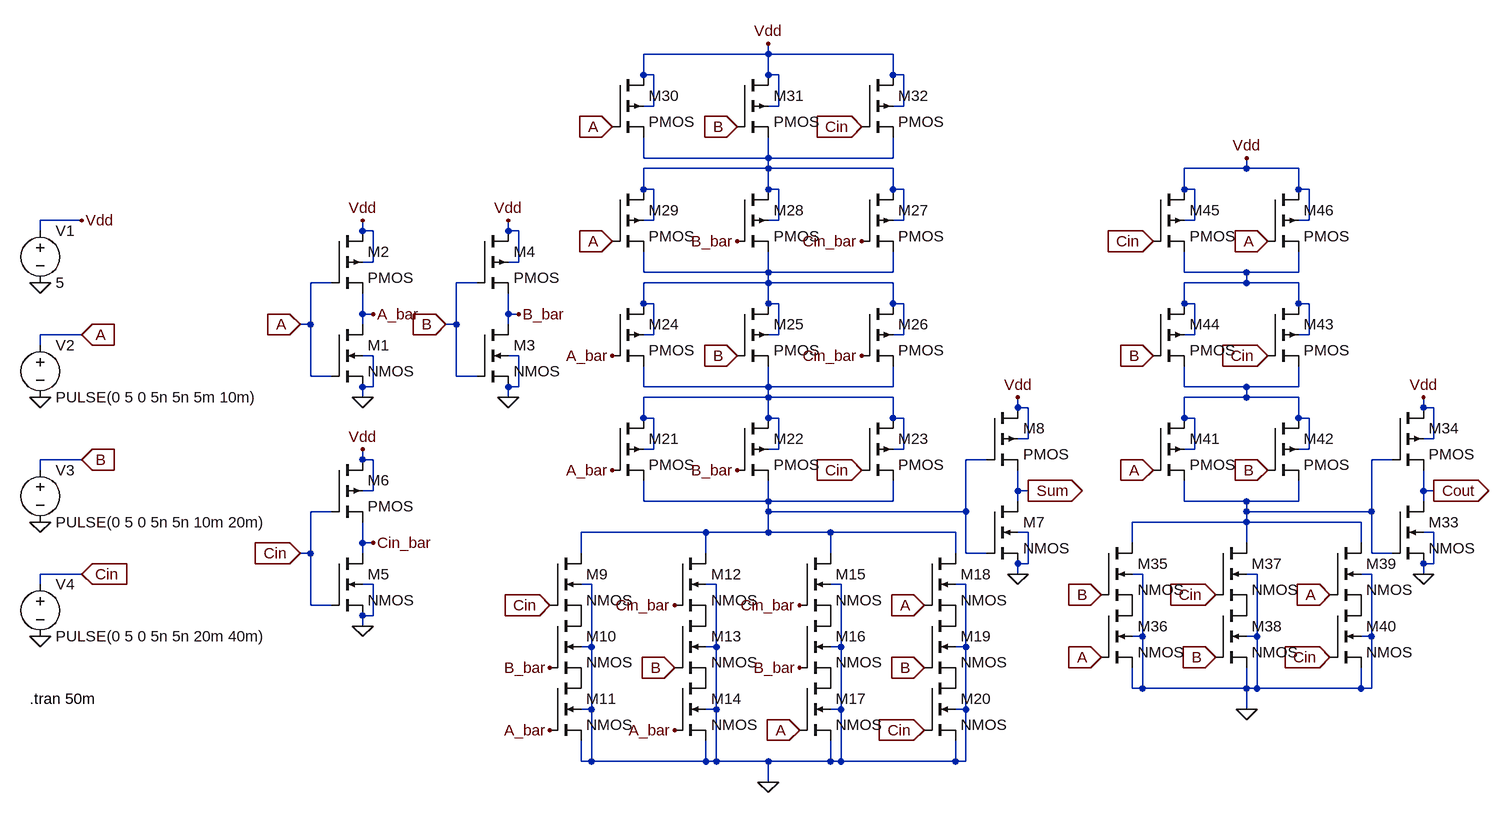
[diagram p0: schematic Full_Adder.asc]
Full_Adder.asc, the LTspice schematic file:
Version 4.1
SHEET 1 2416 1124
WIRE 1056 -224 1056 -240
WIRE 1056 -224 864 -224
WIRE 1248 -224 1056 -224
WIRE 864 -192 864 -224
WIRE 880 -192 864 -192
WIRE 1056 -192 1056 -224
WIRE 1072 -192 1056 -192
WIRE 1248 -192 1248 -224
WIRE 1264 -192 1248 -192
WIRE 880 -144 880 -192
WIRE 880 -144 864 -144
WIRE 1072 -144 1072 -192
WIRE 1072 -144 1056 -144
WIRE 1264 -144 1264 -192
WIRE 1264 -144 1248 -144
WIRE 864 -64 864 -96
WIRE 1056 -64 1056 -96
WIRE 1056 -64 864 -64
WIRE 1248 -64 1248 -96
WIRE 1248 -64 1056 -64
WIRE 1056 -48 1056 -64
WIRE 1056 -48 864 -48
WIRE 1248 -48 1056 -48
WIRE 1792 -48 1792 -64
WIRE 1792 -48 1696 -48
WIRE 1872 -48 1792 -48
WIRE 864 -16 864 -48
WIRE 880 -16 864 -16
WIRE 1056 -16 1056 -48
WIRE 1072 -16 1056 -16
WIRE 1248 -16 1248 -48
WIRE 1264 -16 1248 -16
WIRE 1696 -16 1696 -48
WIRE 1712 -16 1696 -16
WIRE 1872 -16 1872 -48
WIRE 1888 -16 1872 -16
WIRE 0 32 -64 32
WIRE 880 32 880 -16
WIRE 880 32 864 32
WIRE 1072 32 1072 -16
WIRE 1072 32 1056 32
WIRE 1264 32 1264 -16
WIRE 1264 32 1248 32
WIRE 1712 32 1712 -16
WIRE 1712 32 1696 32
WIRE 1888 32 1888 -16
WIRE 1888 32 1872 32
WIRE -64 48 -64 32
WIRE 432 48 432 32
WIRE 448 48 432 48
WIRE 656 48 656 32
WIRE 672 48 656 48
WIRE 448 96 448 48
WIRE 448 96 432 96
WIRE 672 96 672 48
WIRE 672 96 656 96
WIRE 864 112 864 80
WIRE 1056 112 1056 80
WIRE 1056 112 864 112
WIRE 1248 112 1248 80
WIRE 1248 112 1056 112
WIRE 1696 112 1696 80
WIRE 1792 112 1696 112
WIRE 1872 112 1872 80
WIRE 1872 112 1792 112
WIRE 384 128 352 128
WIRE 608 128 576 128
WIRE 1056 128 1056 112
WIRE 1056 128 864 128
WIRE 1248 128 1056 128
WIRE 1792 128 1792 112
WIRE 1792 128 1696 128
WIRE 1872 128 1792 128
WIRE 864 160 864 128
WIRE 880 160 864 160
WIRE 1056 160 1056 128
WIRE 1072 160 1056 160
WIRE 1248 160 1248 128
WIRE 1264 160 1248 160
WIRE 1696 160 1696 128
WIRE 1712 160 1696 160
WIRE 1872 160 1872 128
WIRE 1888 160 1872 160
WIRE 432 176 432 144
WIRE 448 176 432 176
WIRE 656 176 656 144
WIRE 672 176 656 176
WIRE 352 192 352 128
WIRE 352 192 336 192
WIRE 432 192 432 176
WIRE 576 192 576 128
WIRE 576 192 560 192
WIRE 656 192 656 176
WIRE 0 208 -64 208
WIRE 880 208 880 160
WIRE 880 208 864 208
WIRE 1072 208 1072 160
WIRE 1072 208 1056 208
WIRE 1264 208 1264 160
WIRE 1264 208 1248 208
WIRE 1712 208 1712 160
WIRE 1712 208 1696 208
WIRE 1888 208 1888 160
WIRE 1888 208 1872 208
WIRE -64 224 -64 208
WIRE 448 240 432 240
WIRE 672 240 656 240
WIRE 352 272 352 192
WIRE 384 272 352 272
WIRE 576 272 576 192
WIRE 608 272 576 272
WIRE 448 288 448 240
WIRE 448 288 432 288
WIRE 672 288 672 240
WIRE 672 288 656 288
WIRE 864 288 864 256
WIRE 1056 288 1056 256
WIRE 1056 288 864 288
WIRE 1248 288 1248 256
WIRE 1248 288 1056 288
WIRE 1696 288 1696 256
WIRE 1792 288 1696 288
WIRE 1872 288 1872 256
WIRE 1872 288 1792 288
WIRE 432 304 432 288
WIRE 656 304 656 288
WIRE 1056 304 1056 288
WIRE 1056 304 864 304
WIRE 1248 304 1056 304
WIRE 1792 304 1792 288
WIRE 1792 304 1696 304
WIRE 1872 304 1792 304
WIRE 1440 320 1440 304
WIRE 1456 320 1440 320
WIRE 2064 320 2064 304
WIRE 2080 320 2064 320
WIRE 864 336 864 304
WIRE 880 336 864 336
WIRE 1056 336 1056 304
WIRE 1072 336 1056 336
WIRE 1248 336 1248 304
WIRE 1264 336 1248 336
WIRE 1696 336 1696 304
WIRE 1712 336 1696 336
WIRE 1872 336 1872 304
WIRE 1888 336 1872 336
WIRE 1456 368 1456 320
WIRE 1456 368 1440 368
WIRE 2080 368 2080 320
WIRE 2080 368 2064 368
WIRE 880 384 880 336
WIRE 880 384 864 384
WIRE 1072 384 1072 336
WIRE 1072 384 1056 384
WIRE 1264 384 1264 336
WIRE 1264 384 1248 384
WIRE 1712 384 1712 336
WIRE 1712 384 1696 384
WIRE 1888 384 1888 336
WIRE 1888 384 1872 384
WIRE 0 400 -64 400
WIRE 432 400 432 384
WIRE 448 400 432 400
WIRE 1392 400 1360 400
WIRE 2016 400 1984 400
WIRE -64 416 -64 400
WIRE 448 448 448 400
WIRE 448 448 432 448
WIRE 1440 448 1440 416
WIRE 1456 448 1440 448
WIRE 2064 448 2064 416
WIRE 2080 448 2064 448
WIRE 864 464 864 432
WIRE 1056 464 1056 432
WIRE 1056 464 864 464
WIRE 1248 464 1248 432
WIRE 1248 464 1056 464
WIRE 1440 464 1440 448
WIRE 1696 464 1696 432
WIRE 1792 464 1696 464
WIRE 1872 464 1872 432
WIRE 1872 464 1792 464
WIRE 2064 464 2064 448
WIRE 384 480 352 480
WIRE 1056 480 1056 464
WIRE 1360 480 1360 400
WIRE 1360 480 1056 480
WIRE 1792 480 1792 464
WIRE 1984 480 1984 400
WIRE 1984 480 1792 480
WIRE 1792 496 1792 480
WIRE 1792 496 1616 496
WIRE 1968 496 1792 496
WIRE 960 512 768 512
WIRE 1056 512 1056 480
WIRE 1056 512 960 512
WIRE 1152 512 1056 512
WIRE 1344 512 1152 512
WIRE 1456 512 1440 512
WIRE 2080 512 2064 512
WIRE 432 528 432 496
WIRE 448 528 432 528
WIRE 1616 528 1616 496
WIRE 1792 528 1792 496
WIRE 1968 528 1968 496
WIRE 352 544 352 480
WIRE 352 544 336 544
WIRE 432 544 432 528
WIRE 768 544 768 512
WIRE 960 544 960 512
WIRE 1152 544 1152 512
WIRE 1344 544 1344 512
WIRE 1360 544 1360 480
WIRE 1392 544 1360 544
WIRE 1984 544 1984 480
WIRE 2016 544 1984 544
WIRE 1456 560 1456 512
WIRE 1456 560 1440 560
WIRE 2080 560 2080 512
WIRE 2080 560 2064 560
WIRE 0 576 -64 576
WIRE 1440 576 1440 560
WIRE 1632 576 1616 576
WIRE 1808 576 1792 576
WIRE 1984 576 1968 576
WIRE 2064 576 2064 560
WIRE -64 592 -64 576
WIRE 448 592 432 592
WIRE 784 592 768 592
WIRE 976 592 960 592
WIRE 1168 592 1152 592
WIRE 1360 592 1344 592
WIRE 352 624 352 544
WIRE 384 624 352 624
WIRE 448 640 448 592
WIRE 448 640 432 640
WIRE 432 656 432 640
WIRE 1632 672 1632 576
WIRE 1632 672 1616 672
WIRE 1808 672 1808 576
WIRE 1808 672 1792 672
WIRE 1984 672 1984 576
WIRE 1984 672 1968 672
WIRE 784 688 784 592
WIRE 784 688 768 688
WIRE 976 688 976 592
WIRE 976 688 960 688
WIRE 1168 688 1168 592
WIRE 1168 688 1152 688
WIRE 1360 688 1360 592
WIRE 1360 688 1344 688
WIRE 1616 752 1616 720
WIRE 1632 752 1632 672
WIRE 1632 752 1616 752
WIRE 1792 752 1792 720
WIRE 1792 752 1632 752
WIRE 1808 752 1808 672
WIRE 1808 752 1792 752
WIRE 1968 752 1968 720
WIRE 1968 752 1808 752
WIRE 1984 752 1984 672
WIRE 1984 752 1968 752
WIRE 784 784 784 688
WIRE 784 784 768 784
WIRE 976 784 976 688
WIRE 976 784 960 784
WIRE 1168 784 1168 688
WIRE 1168 784 1152 784
WIRE 1360 784 1360 688
WIRE 1360 784 1344 784
WIRE 1792 784 1792 752
WIRE 768 864 768 832
WIRE 784 864 784 784
WIRE 784 864 768 864
WIRE 960 864 960 832
WIRE 960 864 784 864
WIRE 976 864 976 784
WIRE 976 864 960 864
WIRE 1056 864 976 864
WIRE 1152 864 1152 832
WIRE 1152 864 1056 864
WIRE 1168 864 1168 784
WIRE 1168 864 1152 864
WIRE 1344 864 1344 832
WIRE 1344 864 1168 864
WIRE 1360 864 1360 784
WIRE 1360 864 1344 864
WIRE 1056 896 1056 864
FLAG -64 128 0
FLAG -64 304 0
FLAG -64 496 0
FLAG -64 672 0
FLAG 0 32 Vdd
FLAG 0 208 A
IOPIN 0 208 In
FLAG 0 400 B
IOPIN 0 400 In
FLAG 0 576 Cin
IOPIN 0 576 In
FLAG 432 32 Vdd
FLAG 432 304 0
FLAG 656 32 Vdd
FLAG 656 304 0
FLAG 432 384 Vdd
FLAG 432 656 0
FLAG 1440 304 Vdd
FLAG 1440 576 0
FLAG 336 192 A
IOPIN 336 192 In
FLAG 560 192 B
IOPIN 560 192 In
FLAG 336 544 Cin
IOPIN 336 544 In
FLAG 448 176 A_bar
FLAG 672 176 B_bar
FLAG 448 528 Cin_bar
FLAG 1056 896 0
FLAG 1056 -240 Vdd
FLAG 2064 304 Vdd
FLAG 2064 576 0
FLAG 1792 784 0
FLAG 1792 -64 Vdd
FLAG 1456 448 Sum
IOPIN 1456 448 Out
FLAG 2080 448 Cout
IOPIN 2080 448 Out
FLAG 720 816 A_bar
FLAG 720 720 B_bar
FLAG 720 624 Cin
IOPIN 720 624 In
FLAG 912 816 A_bar
FLAG 912 720 B
IOPIN 912 720 In
FLAG 912 624 Cin_bar
FLAG 1104 816 A
IOPIN 1104 816 In
FLAG 1104 720 B_bar
FLAG 1104 624 Cin_bar
FLAG 1296 624 A
IOPIN 1296 624 In
FLAG 1296 720 B
IOPIN 1296 720 In
FLAG 1296 816 Cin
IOPIN 1296 816 In
FLAG 816 416 A_bar
FLAG 1008 416 B_bar
FLAG 1200 416 Cin
IOPIN 1200 416 In
FLAG 816 240 A_bar
FLAG 1008 240 B
IOPIN 1008 240 In
FLAG 1200 240 Cin_bar
FLAG 816 64 A
IOPIN 816 64 In
FLAG 1008 64 B_bar
FLAG 1200 64 Cin_bar
FLAG 816 -112 A
IOPIN 816 -112 In
FLAG 1008 -112 B
IOPIN 1008 -112 In
FLAG 1200 -112 Cin
IOPIN 1200 -112 In
FLAG 1568 704 A
IOPIN 1568 704 In
FLAG 1568 608 B
IOPIN 1568 608 In
FLAG 1648 416 A
IOPIN 1648 416 In
FLAG 1824 416 B
IOPIN 1824 416 In
FLAG 1744 704 B
IOPIN 1744 704 In
FLAG 1744 608 Cin
IOPIN 1744 608 In
FLAG 1648 240 B
IOPIN 1648 240 In
FLAG 1824 240 Cin
IOPIN 1824 240 In
FLAG 1648 64 Cin
IOPIN 1648 64 In
FLAG 1824 64 A
IOPIN 1824 64 In
FLAG 1920 704 Cin
IOPIN 1920 704 In
FLAG 1920 608 A
IOPIN 1920 608 In
SYMBOL voltage -64 32 R0
WINDOW 123 0 0 Left 0
WINDOW 39 0 0 Left 0
SYMATTR InstName V1
SYMATTR Value 5
SYMBOL voltage -64 208 R0
WINDOW 123 0 0 Left 0
WINDOW 39 0 0 Left 0
SYMATTR InstName V2
SYMATTR Value PULSE(0 5 0 5n 5n 5m 10m)
SYMBOL voltage -64 400 R0
WINDOW 123 0 0 Left 0
WINDOW 39 0 0 Left 0
SYMATTR InstName V3
SYMATTR Value PULSE(0 5 0 5n 5n 10m 20m)
SYMBOL voltage -64 576 R0
WINDOW 123 0 0 Left 0
WINDOW 39 0 0 Left 0
SYMATTR InstName V4
SYMATTR Value PULSE(0 5 0 5n 5n 20m 40m)
SYMBOL nmos4 384 192 R0
SYMATTR InstName M1
SYMBOL pmos4 384 48 R0
SYMATTR InstName M2
SYMBOL nmos4 608 192 R0
SYMATTR InstName M3
SYMBOL pmos4 608 48 R0
SYMATTR InstName M4
SYMBOL nmos4 384 544 R0
SYMATTR InstName M5
SYMBOL pmos4 384 400 R0
SYMATTR InstName M6
SYMBOL nmos4 1392 464 R0
SYMATTR InstName M7
SYMBOL pmos4 1392 320 R0
SYMATTR InstName M8
SYMBOL nmos4 720 544 R0
SYMATTR InstName M9
SYMBOL nmos4 720 640 R0
SYMATTR InstName M10
SYMBOL nmos4 720 736 R0
SYMATTR InstName M11
SYMBOL nmos4 912 544 R0
SYMATTR InstName M12
SYMBOL nmos4 912 640 R0
SYMATTR InstName M13
SYMBOL nmos4 912 736 R0
SYMATTR InstName M14
SYMBOL nmos4 1104 544 R0
SYMATTR InstName M15
SYMBOL nmos4 1104 640 R0
SYMATTR InstName M16
SYMBOL nmos4 1104 736 R0
SYMATTR InstName M17
SYMBOL nmos4 1296 544 R0
SYMATTR InstName M18
SYMBOL nmos4 1296 640 R0
SYMATTR InstName M19
SYMBOL nmos4 1296 736 R0
SYMATTR InstName M20
SYMBOL pmos4 816 336 R0
SYMATTR InstName M21
SYMBOL pmos4 1008 336 R0
SYMATTR InstName M22
SYMBOL pmos4 1200 336 R0
SYMATTR InstName M23
SYMBOL pmos4 816 160 R0
SYMATTR InstName M24
SYMBOL pmos4 1008 160 R0
SYMATTR InstName M25
SYMBOL pmos4 1200 160 R0
SYMATTR InstName M26
SYMBOL pmos4 1200 -16 R0
SYMATTR InstName M27
SYMBOL pmos4 1008 -16 R0
SYMATTR InstName M28
SYMBOL pmos4 816 -16 R0
SYMATTR InstName M29
SYMBOL pmos4 816 -192 R0
SYMATTR InstName M30
SYMBOL pmos4 1008 -192 R0
SYMATTR InstName M31
SYMBOL pmos4 1200 -192 R0
SYMATTR InstName M32
SYMBOL nmos4 2016 464 R0
SYMATTR InstName M33
SYMBOL pmos4 2016 320 R0
SYMATTR InstName M34
SYMBOL nmos4 1568 528 R0
SYMATTR InstName M35
SYMBOL nmos4 1568 624 R0
SYMATTR InstName M36
SYMBOL nmos4 1744 528 R0
SYMATTR InstName M37
SYMBOL nmos4 1744 624 R0
SYMATTR InstName M38
SYMBOL nmos4 1920 528 R0
SYMATTR InstName M39
SYMBOL nmos4 1920 624 R0
SYMATTR InstName M40
SYMBOL pmos4 1648 336 R0
SYMATTR InstName M41
SYMBOL pmos4 1824 336 R0
SYMATTR InstName M42
SYMBOL pmos4 1824 160 R0
SYMATTR InstName M43
SYMBOL pmos4 1648 160 R0
SYMATTR InstName M44
SYMBOL pmos4 1648 -16 R0
SYMATTR InstName M45
SYMBOL pmos4 1824 -16 R0
SYMATTR InstName M46
TEXT -80 768 Left 2 !.tran 50m

The netlist it stands for:
* Full_Adder.asc
V1 Vdd 0 5
V2 A 0 PULSE(0 5 0 5n 5n 5m 10m)
V3 B 0 PULSE(0 5 0 5n 5n 10m 20m)
V4 Cin 0 PULSE(0 5 0 5n 5n 20m 40m)
M1 A_bar A 0 0 NMOS
M2 Vdd A A_bar Vdd PMOS
M3 B_bar B 0 0 NMOS
M4 Vdd B B_bar Vdd PMOS
M5 Cin_bar Cin 0 0 NMOS
M6 Vdd Cin Cin_bar Vdd PMOS
M7 Sum N006 0 0 NMOS
M8 Vdd N006 Sum Vdd PMOS
M9 N006 Cin P001 0 NMOS
M10 P001 B_bar P002 0 NMOS
M11 P002 A_bar 0 0 NMOS
M12 N006 Cin_bar P003 0 NMOS
M13 P003 B P004 0 NMOS
M14 P004 A_bar 0 0 NMOS
M15 N006 Cin_bar P005 0 NMOS
M16 P005 B_bar P006 0 NMOS
M17 P006 A 0 0 NMOS
M18 N006 A P007 0 NMOS
M19 P007 B P008 0 NMOS
M20 P008 Cin 0 0 NMOS
M21 N004 A_bar N006 N004 PMOS
M22 N004 B_bar N006 N004 PMOS
M23 N004 Cin N006 N004 PMOS
M24 N002 A_bar N004 N002 PMOS
M25 N002 B N004 N002 PMOS
M26 N002 Cin_bar N004 N002 PMOS
M27 N001 Cin_bar N002 N001 PMOS
M28 N001 B_bar N002 N001 PMOS
M29 N001 A N002 N001 PMOS
M30 Vdd A N001 Vdd PMOS
M31 Vdd B N001 Vdd PMOS
M32 Vdd Cin N001 Vdd PMOS
M33 Cout N007 0 0 NMOS
M34 Vdd N007 Cout Vdd PMOS
M35 N007 B P009 0 NMOS
M36 P009 A 0 0 NMOS
M37 N007 Cin P010 0 NMOS
M38 P010 B 0 0 NMOS
M39 N007 A P011 0 NMOS
M40 P011 Cin 0 0 NMOS
M41 N005 A N007 N005 PMOS
M42 N005 B N007 N005 PMOS
M43 N003 Cin N005 N003 PMOS
M44 N003 B N005 N003 PMOS
M45 Vdd Cin N003 Vdd PMOS
M46 Vdd A N003 Vdd PMOS
.model NMOS NMOS
.model PMOS PMOS
.lib standard.mos
.tran 50m
.backanno
.end